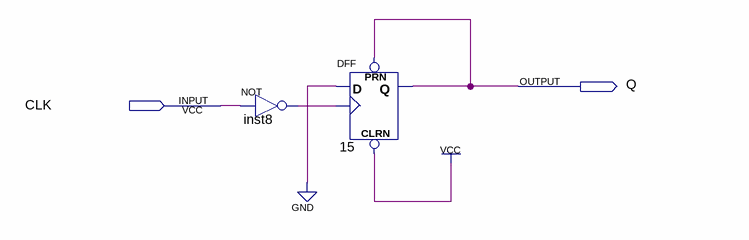
[diagram p0: schematic sheet]
// Quartus schematic Strobe.bdf as structural Verilog: 2 symbols, 2 pins
module Strobe (
  input  CLK,
  output Q
);

  wire inst8_out;

  not inst8 (inst8_out, CLK);
  DFF u_15 (.CLRN(1'b1), .CLK(inst8_out), .D(1'b0), .PRN(Q), .Q(Q));
endmodule
